# Altium schematic sheet SDMMC RV1126B.SchDoc: SDMMC0
size A4; DrawnBy: ThanhQuoc; Revision: V01; SheetNumber: 11; SheetTotal: 21; Project: RV1126 CAMERA BOARD DESIGN
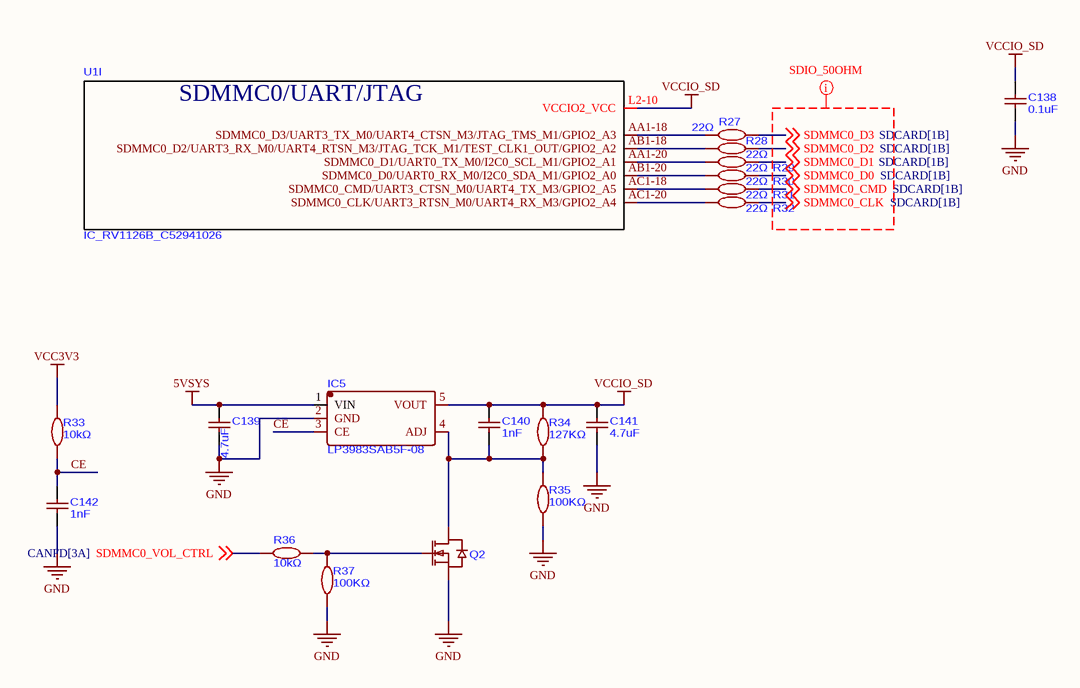
[diagram p0: SDMMC RV1126B.SchDoc]

## Parts
C138  0.1uF  [C0201]
C139  4.7uF  [C0402]
C140  1nF  [C0201]
C141  4.7uF  [C0402]
C142  1nF  [C0201]
IC5  LP3983SAB5F-08  [SOT-23-5_L3.0-W1.7-P0.95-LS2.8-BR]
Q2  N-CHANEL  [SOT-23-3_L2.9-W1.3-P1.90-LS2.4-BR]  (value not drawn)
R27  22Ω  [R0201]
R28  22Ω  [R0201]
R29  22Ω  [R0201]
R30  22Ω  [R0201]
R31  22Ω  [R0201]
R32  22Ω  [R0201]
R33  10kΩ  [R0201]
R34  127KΩ  [R0201]
R35  100KΩ  [R0201]
R36  10kΩ  [R0201]
R37  100KΩ  [R0201]
U1  IC_RV1126B_C52941026  [CCSP-491_L14.0-W14.0-TL_RV1126B]  (part I of 18)

## Nets
5VSYS: C139.2 IC5.1(VIN)
GND: C138.2 C139.1 C141.2 C142.1 IC5.2(GND) Q2.2(S) R35.1 R37.1
VCC3V3: R33.1
VCCIO_SD: C138.1 C140.2 C141.1 IC5.5(VOUT) R34.2 U1.L2-10(VCCIO2_VCC)
CE: C142.2 IC5.3(CE) R33.2
SDMMC0_CLK: R32.2 ; off-sheet SDMMC0_CLK
SDMMC0_CMD: R31.2 ; off-sheet SDMMC0_CMD
SDMMC0_D0: R30.2 ; off-sheet SDMMC0_D0
SDMMC0_D1: R29.2 ; off-sheet SDMMC0_D1
SDMMC0_D2: R28.2 ; off-sheet SDMMC0_D2
SDMMC0_D3: R27.2 ; off-sheet SDMMC0_D3
SDMMC0_VOL_CTRL: R36.1 ; off-sheet SDMMC0_VOL_CTRL
NetC140_1: C140.1 IC5.4(ADJ) Q2.3(D) R34.1 R35.2
NetQ2_1: Q2.1(G) R36.2 R37.2
NetR27_1: R27.1 U1.AA1-18(SDMMC0_D3/UART3_TX_M0/UART4_CTSN_M3/JTAG_TMS_M1/GPIO2_A3)
NetR28_1: R28.1 U1.AB1-18(SDMMC0_D2/UART3_RX_M0/UART4_RTSN_M3/JTAG_TCK_M1/TEST_CLK1_OUT/GPIO2_A2)
NetR29_1: R29.1 U1.AA1-20(SDMMC0_D1/UART0_TX_M0/I2C0_SCL_M1/GPIO2_A1)
NetR30_1: R30.1 U1.AB1-20(SDMMC0_D0/UART0_RX_M0/I2C0_SDA_M1/GPIO2_A0)
NetR31_1: R31.1 U1.AC1-18(SDMMC0_CMD/UART3_CTSN_M0/UART4_TX_M3/GPIO2_A5)
NetR32_1: R32.1 U1.AC1-20(SDMMC0_CLK/UART3_RTSN_M0/UART4_RX_M3/GPIO2_A4)

## Layout directives
net class SDIO_50OHM: SDMMC0_CLK, SDMMC0_CMD, SDMMC0_D0, SDMMC0_D1, SDMMC0_D2, SDMMC0_D3

## Notes on the sheet
- Title:
- Drawn By:
- Page Contents:
- Checked By:
- Size:
- Date:
- File:
- License:
- Email:
- A4
- nguyenthanhquoc0206@gmail.com
- Number:
- Time:
- Revision:
- Sheet
- Website:
- of
- https://www.facebook.com/ntq.687
- (in symbol IC_RV1126B_C52941026, part I) SDMMC0/UART/JTAG

## Library data of the parts
C138 = CAP_100nF-6.3V-10%-0201_1: 0.1uF ±10% 6.3V Ceramic Capacitor X5R 0201
C139 C141 = CAP_4.7uF-16V-10%-0402: 4.7uF ±10% 16V Ceramic Capacitor X5R 0402
C140 C142 = CAP_1nF-50V-10%-0201: CAP CER 1nF 50V X7R 0201
IC5 = LP3983SAB5F-08: 300mA, Ultra-low noise, Small Package Ultra-Fast CMOS LDO Regulator; ComponentLink1Description: LCSC; ComponentLink1URL: https://www.lcsc.com/product-detail/C324567.html?s_z=n_q_LP3983SAB5F-08&spm=wm.fly.bg.0.xh&lcsc_vid=EwRWBFZSQVIPVFdUTlJfVldeFFRYUFQAElRYBFRRE1MxVlNeRVlfX1BQRFFcUTsOAxUeFF5JWBYZEEoKFBINSQcJGk4dAgUUFAk%3D
Q2 = JSM2302A-A2SHB: MOSFET N-CH 20V 3A SOT-23
R27-R32 = RES_22-50mW-1%-0201: RES 22Ω ±1% 50mW 0201; ComponentLink1Description: LCSC; ComponentLink1URL: https://www.lcsc.com/product-detail/C295718.html?s_z=n_q_t_120%2520OHM&spm=wm.fly.bg.5.xh___wm.ssy.tc.1.tz&lcsc_vid=EwRWBFZSQVIPVFdUTlJfVldeFFRYUFQAElRYBFRRE1MxVlNeRFZeU1BfTlBYVzsOAxUeFF5JWBYZEEoKFBINSQcJGk4eFQsCAgIaSgADAwAHC0slRVhcV1ZTT08GEwkK
R33 R36 = RES_10K-50mW-1%-0201: RES 10KΩ ±1% 50mW 0201; ComponentLink1Description: LCSC; ComponentLink1URL: https://www.lcsc.com/product-detail/C93949.html?spm=wm.fly.bg.0.xh&lcsc_vid=EwRWBFZSQVIPVFdUTlJfVldeFFRYUFQAElRYBFRRE1MxVlNeRVlXUFNQQ1RWXjsOAxUeFF5JWBYZEEoKFBINSQcJGk4eFQsCAgIaSgADAwAHC0slRlVYUFFIHxUDCw%3D%3D
R34 = RES_127K-50mW-1%-0201: RES 127kΩ ±1% 50mW 0201; ComponentLink1Description: LCSC; ComponentLink1URL: https://www.lcsc.com/product-detail/C295718.html?s_z=n_q_t_120%2520OHM&spm=wm.fly.bg.5.xh___wm.ssy.tc.1.tz&lcsc_vid=EwRWBFZSQVIPVFdUTlJfVldeFFRYUFQAElRYBFRRE1MxVlNeRFZeU1BfTlBYVzsOAxUeFF5JWBYZEEoKFBINSQcJGk4eFQsCAgIaSgADAwAHC0slRVhcV1ZTT08GEwkK
R35 = RES_100K-50mW-1%-0201: RES 100kΩ ±1% 50mW 0201; ComponentLink1Description: LCSC; ComponentLink1URL: https://www.lcsc.com/product-detail/C295718.html?s_z=n_q_t_120%2520OHM&spm=wm.fly.bg.5.xh___wm.ssy.tc.1.tz&lcsc_vid=EwRWBFZSQVIPVFdUTlJfVldeFFRYUFQAElRYBFRRE1MxVlNeRFZeU1BfTlBYVzsOAxUeFF5JWBYZEEoKFBINSQcJGk4eFQsCAgIaSgADAwAHC0slRVhcV1ZTT08GEwkK
R37 = RES_47K-50mW-1%-0201: 47kΩ 50mW 25V Thick Film Resistor ±1% ±200ppm/℃ 0201 Chip Resistor - Surface Mount RoHS; ComponentLink1Description: LCSC; ComponentLink1URL: https://www.lcsc.com/product-detail/C295718.html?s_z=n_q_t_120%2520OHM&spm=wm.fly.bg.5.xh___wm.ssy.tc.1.tz&lcsc_vid=EwRWBFZSQVIPVFdUTlJfVldeFFRYUFQAElRYBFRRE1MxVlNeRFZeU1BfTlBYVzsOAxUeFF5JWBYZEEoKFBINSQcJGk4eFQsCAgIaSgADAwAHC0slRVhcV1ZTT08GEwkK